# Altium schematic sheet board.SchDoc
size C
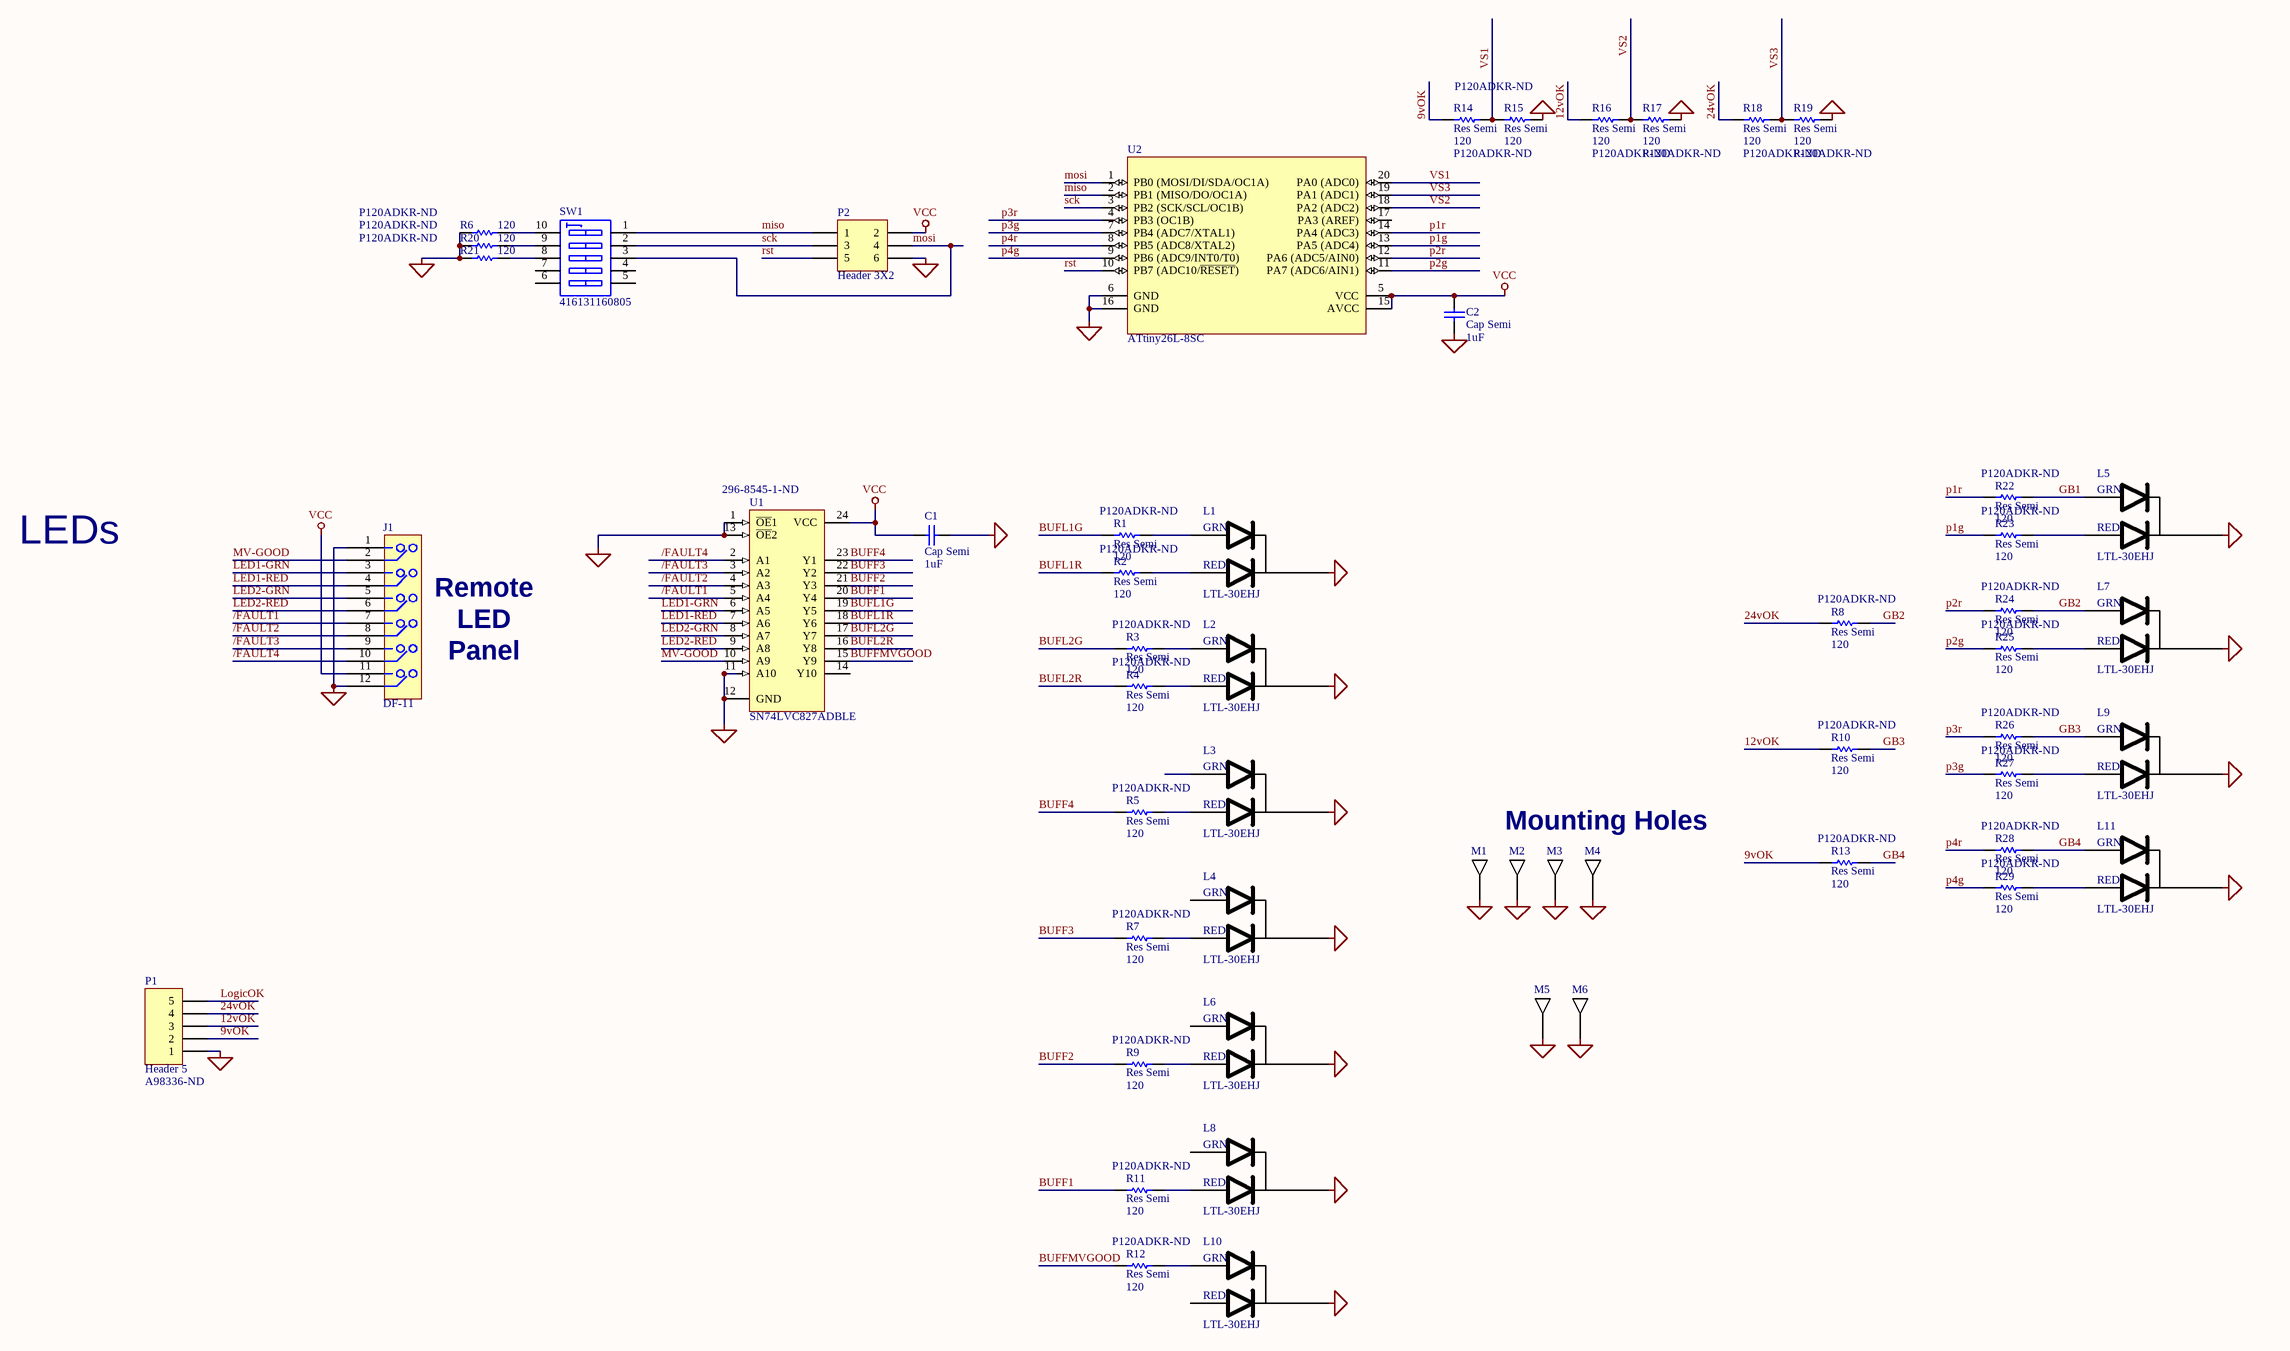
[diagram p0: board.SchDoc]

## Parts
C1  Cap Semi  value 1uF  [CAPC2512L]
C2  Cap Semi  value 1uF  [CAPC2512L]
J1  DF-11  [HDR-6x2-2MM]
L1  LTL-30EHJ  [LTL-30EHJ]
L2  LTL-30EHJ  [LTL-30EHJ]
L3  LTL-30EHJ  [LTL-30EHJ]
L4  LTL-30EHJ  [LTL-30EHJ]
L5  LTL-30EHJ  [LTL-30EHJ]
L6  LTL-30EHJ  [LTL-30EHJ]
L7  LTL-30EHJ  [LTL-30EHJ]
L8  LTL-30EHJ  [LTL-30EHJ]
L9  LTL-30EHJ  [LTL-30EHJ]
L10  LTL-30EHJ  [LTL-30EHJ]
L11  LTL-30EHJ  [LTL-30EHJ]
M1  MHOLE  [MHOLE4]  (value not drawn)  (no BOM)
M2  MHOLE  [MHOLE4]  (value not drawn)  (no BOM)
M3  MHOLE  [MHOLE4]  (value not drawn)  (no BOM)
M4  MHOLE  [MHOLE4]  (value not drawn)  (no BOM)
M5  MHOLE  [MHOLE4]  (value not drawn)  (no BOM)
M6  MHOLE  [MHOLE4]  (value not drawn)  (no BOM)
P1  Header 5  Supplier Part Number 1: A98336-ND  [HDR1X5]
P2  Header 3X2  [HDR2X3]
R1  Res Semi  value 120  Supplier Part Number 1: P120ADKR-ND  [RESC2012L]
R2  Res Semi  value 120  Supplier Part Number 1: P120ADKR-ND  [RESC2012L]
R3  Res Semi  value 120  Supplier Part Number 1: P120ADKR-ND  [RESC2012L]
R4  Res Semi  value 120  Supplier Part Number 1: P120ADKR-ND  [RESC2012L]
R5  Res Semi  value 120  Supplier Part Number 1: P120ADKR-ND  [RESC2012L]
R6  value 120  Supplier Part Number 1: P120ADKR-ND  [RESC2012L]  (hidden comment: Res Semi)
R7  Res Semi  value 120  Supplier Part Number 1: P120ADKR-ND  [RESC2012L]
R8  Res Semi  value 120  Supplier Part Number 1: P120ADKR-ND  [RESC2012L]
R9  Res Semi  value 120  Supplier Part Number 1: P120ADKR-ND  [RESC2012L]
R10  Res Semi  value 120  Supplier Part Number 1: P120ADKR-ND  [RESC2012L]
R11  Res Semi  value 120  Supplier Part Number 1: P120ADKR-ND  [RESC2012L]
R12  Res Semi  value 120  Supplier Part Number 1: P120ADKR-ND  [RESC2012L]
R13  Res Semi  value 120  Supplier Part Number 1: P120ADKR-ND  [RESC2012L]
R14  Res Semi  value 120  Supplier Part Number 1: P120ADKR-ND  [RESC2012L]
R15  Res Semi  value 120  Supplier Part Number 1: P120ADKR-ND  [RESC2012L]
R16  Res Semi  value 120  Supplier Part Number 1: P120ADKR-ND  [RESC2012L]
R17  Res Semi  value 120  Supplier Part Number 1: P120ADKR-ND  [RESC2012L]
R18  Res Semi  value 120  Supplier Part Number 1: P120ADKR-ND  [RESC2012L]
R19  Res Semi  value 120  Supplier Part Number 1: P120ADKR-ND  [RESC2012L]
R20  value 120  Supplier Part Number 1: P120ADKR-ND  [RESC2012L]  (hidden comment: Res Semi)
R21  value 120  Supplier Part Number 1: P120ADKR-ND  [RESC2012L]  (hidden comment: Res Semi)
R22  Res Semi  value 120  Supplier Part Number 1: P120ADKR-ND  [RESC2012L]
R23  Res Semi  value 120  Supplier Part Number 1: P120ADKR-ND  [RESC2012L]
R24  Res Semi  value 120  Supplier Part Number 1: P120ADKR-ND  [RESC2012L]
R25  Res Semi  value 120  Supplier Part Number 1: P120ADKR-ND  [RESC2012L]
R26  Res Semi  value 120  Supplier Part Number 1: P120ADKR-ND  [RESC2012L]
R27  Res Semi  value 120  Supplier Part Number 1: P120ADKR-ND  [RESC2012L]
R28  Res Semi  value 120  Supplier Part Number 1: P120ADKR-ND  [RESC2012L]
R29  Res Semi  value 120  Supplier Part Number 1: P120ADKR-ND  [RESC2012L]
SW1  416131160805  [416131160805]
U1  SN74LVC827ADBLE  Supplier Part Number 1: 296-8545-1-ND  [DB024_N]
U2  ATtiny26L-8SC  [20S_N]

## Nets
GND: C1.2 C2.1 J1.1 J1.12 L1.2 L2.2 L3.2 L4.2 L5.2 L6.2 L7.2 L8.2 L9.2 L10.2 L11.2 M1.1 M2.1 M3.1 M4.1 M5.1 M6.1 P1.1 P2.6 R6.1 R15.1 R17.1 R19.1 R20.1 R21.1 U1.1(~{OE}1) U1.11(A10) U1.12(GND) U1.13(~{OE}2) U2.6(GND) U2.16(GND)
VCC: C1.1 C2.2 J1.11 P2.2 U1.24(VCC) U2.5(VCC) U2.15(AVCC)
9vOK: P1.2 R13.1 R14.2
12vOK: P1.3 R10.1 R16.2
24vOK: P1.4 R8.1 R18.2
/FAULT1: J1.7 U1.5(A4)
/FAULT2: J1.8 U1.4(A3)
/FAULT3: J1.9 U1.3(A2)
/FAULT4: J1.10 U1.2(A1)
BUFF1: R11.1 U1.20(Y4)
BUFF2: R9.1 U1.21(Y3)
BUFF3: R7.1 U1.22(Y2)
BUFF4: R5.1 U1.23(Y1)
BUFFMVGOOD: R12.1 U1.15(Y9)
BUFL1G: R1.1 U1.19(Y5)
BUFL1R: R2.1 U1.18(Y6)
BUFL2G: R3.1 U1.17(Y7)
BUFL2R: R4.1 U1.16(Y8)
GB1: L5.3(G) R22.2
GB2: L7.3(G) R8.2 R24.2
GB3: L9.3(G) R10.2 R26.2
GB4: L11.3(G) R13.2 R28.2
LED1-GRN: J1.3 U1.6(A5)
LED1-RED: J1.4 U1.7(A6)
LED2-GRN: J1.5 U1.8(A7)
LED2-RED: J1.6 U1.9(A8)
LogicOK: P1.5
miso: P2.1 SW1.1 U2.2(PB1_(MISO/DO/OC1A))
mosi: P2.4 SW1.3 U2.1(PB0_(MOSI/DI/SDA/OC1A))
MV-GOOD: J1.2 U1.10(A9)
p1g: R23.1 U2.13(PA5_(ADC4))
p1r: R22.1 U2.14(PA4_(ADC3))
p2g: R25.1 U2.11(PA7_(ADC6/AIN1))
p2r: R24.1 U2.12(PA6_(ADC5/AIN0))
p3g: R27.1 U2.7(PB4_(ADC7/XTAL1))
p3r: R26.1 U2.4(PB3_(OC1B))
p4g: R29.1 U2.9(PB6_(ADC9/INT0/T0))
p4r: R28.1 U2.8(PB5_(ADC8/XTAL2))
rst: P2.5 U2.10(PB7_(ADC10/~{RESET}))
sck: P2.3 SW1.2 U2.3(PB2_(SCK/SCL/OC1B))
VS1: R14.1 R15.2 U2.20(PA0_(ADC0))
VS2: R16.1 R17.2 U2.18(PA2_(ADC2))
VS3: R18.1 R19.2 U2.19(PA1_(ADC1))
NetL1_1: L1.1(R) R2.2
NetL1_3: L1.3(G) R1.2
NetL2_1: L2.1(R) R4.2
NetL2_3: L2.3(G) R3.2
NetL3_1: L3.1(R) R5.2
NetL4_1: L4.1(R) R7.2
NetL5_1: L5.1(R) R23.2
NetL6_1: L6.1(R) R9.2
NetL7_1: L7.1(R) R25.2
NetL8_1: L8.1(R) R11.2
NetL9_1: L9.1(R) R27.2
NetL10_3: L10.3(G) R12.2
NetL11_1: L11.1(R) R29.2
NetR6_2: R6.2 SW1.10
NetR20_2: R20.2 SW1.9
NetR21_2: R21.2 SW1.8

Not connected (* = marked no-connect by the designer): L3 3(G); L4 3(G); L6 3(G); L8 3(G); L10 1(R); SW1 4 5 6 7; U1 14(Y10); U2 17(PA3_(AREF))

## Notes on the sheet
- LEDs
- Remote
- Panel
- LED
- Mounting Holes
- (in symbol LTL-30EHJ) GRN; RED

## Library data of the parts
C1 C2 = Cap Semi: Capacitor (Semiconductor SIM Model); Published: 8-Jun-2000; LatestRevisionDate: 29-May-2009; LatestRevisionNote: IPC-7351 Footprint Added.; PackageReference: C1206; Publisher: Altium Limited; PackageDescription: Chip Capacitor
J1 = HEADER 6X2-1
M1-M6 = MHOLE: Mounting Hole
P1 = Header 5: Header, 5-Pin; LatestRevisionDate: 17-Jul-2002; LatestRevisionNote: Re-released for DXP Platform.; Publisher: Altium Limited; Supplier 1: Digi-Key
P2 = Header 3X2: Header, 3-Pin, Dual row; LatestRevisionDate: 17-Jul-2002; LatestRevisionNote: Re-released for DXP Platform.; Publisher: Altium Limited
R1-R29 = Res Semi: Semiconductor Resistor; Published: 8-Jun-2000; LatestRevisionDate: 17-Jul-2002; LatestRevisionNote: Re-released for DXP Platform.; PackageReference: AXIAL-0.5; Publisher: Altium Limited; Supplier 1: Digi-Key
SW1 = CMP-1433-00005-1: WS-DISV 1.27 mm small compact SMD Dip Switch with top tape; Manufacturer: Wuerth Elektronik; NoPins: 10; ComponentLink2URL: http://katalog.we-online.de/em/datasheet/4161311608xx.pdf; ComponentLink1URL: http://www.we-online.com; PartNumber: 416131160805; PackageReference: 416131160805; ComponentLink2Description: Datasheet; ComponentLink1Description: Manufacturer URL
U1 = SN74LVC827ADBLE: 10-Bit Buffer/Driver with 3-State Outputs; ComponentAvailability: Obsolete; Published: 8-Jun-2000; LatestRevisionDate: 16-Oct-2006; LatestRevisionNote: IPC-7351 Footprint Added.; DatasheetVersion: Jun-1998; PackageVersion: May-1999; PackageReference: DB024; Publisher: Altium Limited; PackageDescription: 24-Pin Plastic Small Outline Package 0.65 mm Pitch; Code_JEDEC: MO-150-AG; Code_IPC: SOP65P780-24; ComponentLink1Description: Manufacturer Link; ComponentLink1URL: http://www.ti.com/; ComponentLink2Description: Datasheet; ComponentLink2URL: http://www-s.ti.com/sc/ds/sn74lvc827a.pdf; Supplier 1: Digi-Key
U2 = ATtiny26L-8SC: 8-Bit AVR Microcontroller with 2K Bytes of Flash Memory; Published: 17-Sep-2003; LatestRevisionDate: 13-Apr-2006; LatestRevisionNote: IPC-7351 Footprint Added.; DatasheetVersion: 1477C-AVR-09/02; PackageVersion: Aug-1999; PackageReference: 20S; Publisher: Altium Limited; PackageDescription: 20-Pin Small Outline Integrated Circuit 1.27 mm Pitch; ComponentLink1Description: Manufacturer Link; ComponentLink1URL: http://www.atmel.com; ComponentLink2Description: Datasheet; ComponentLink2URL: http://www.atmel.com/dyn/resources/prod_documents/doc1477.pdf